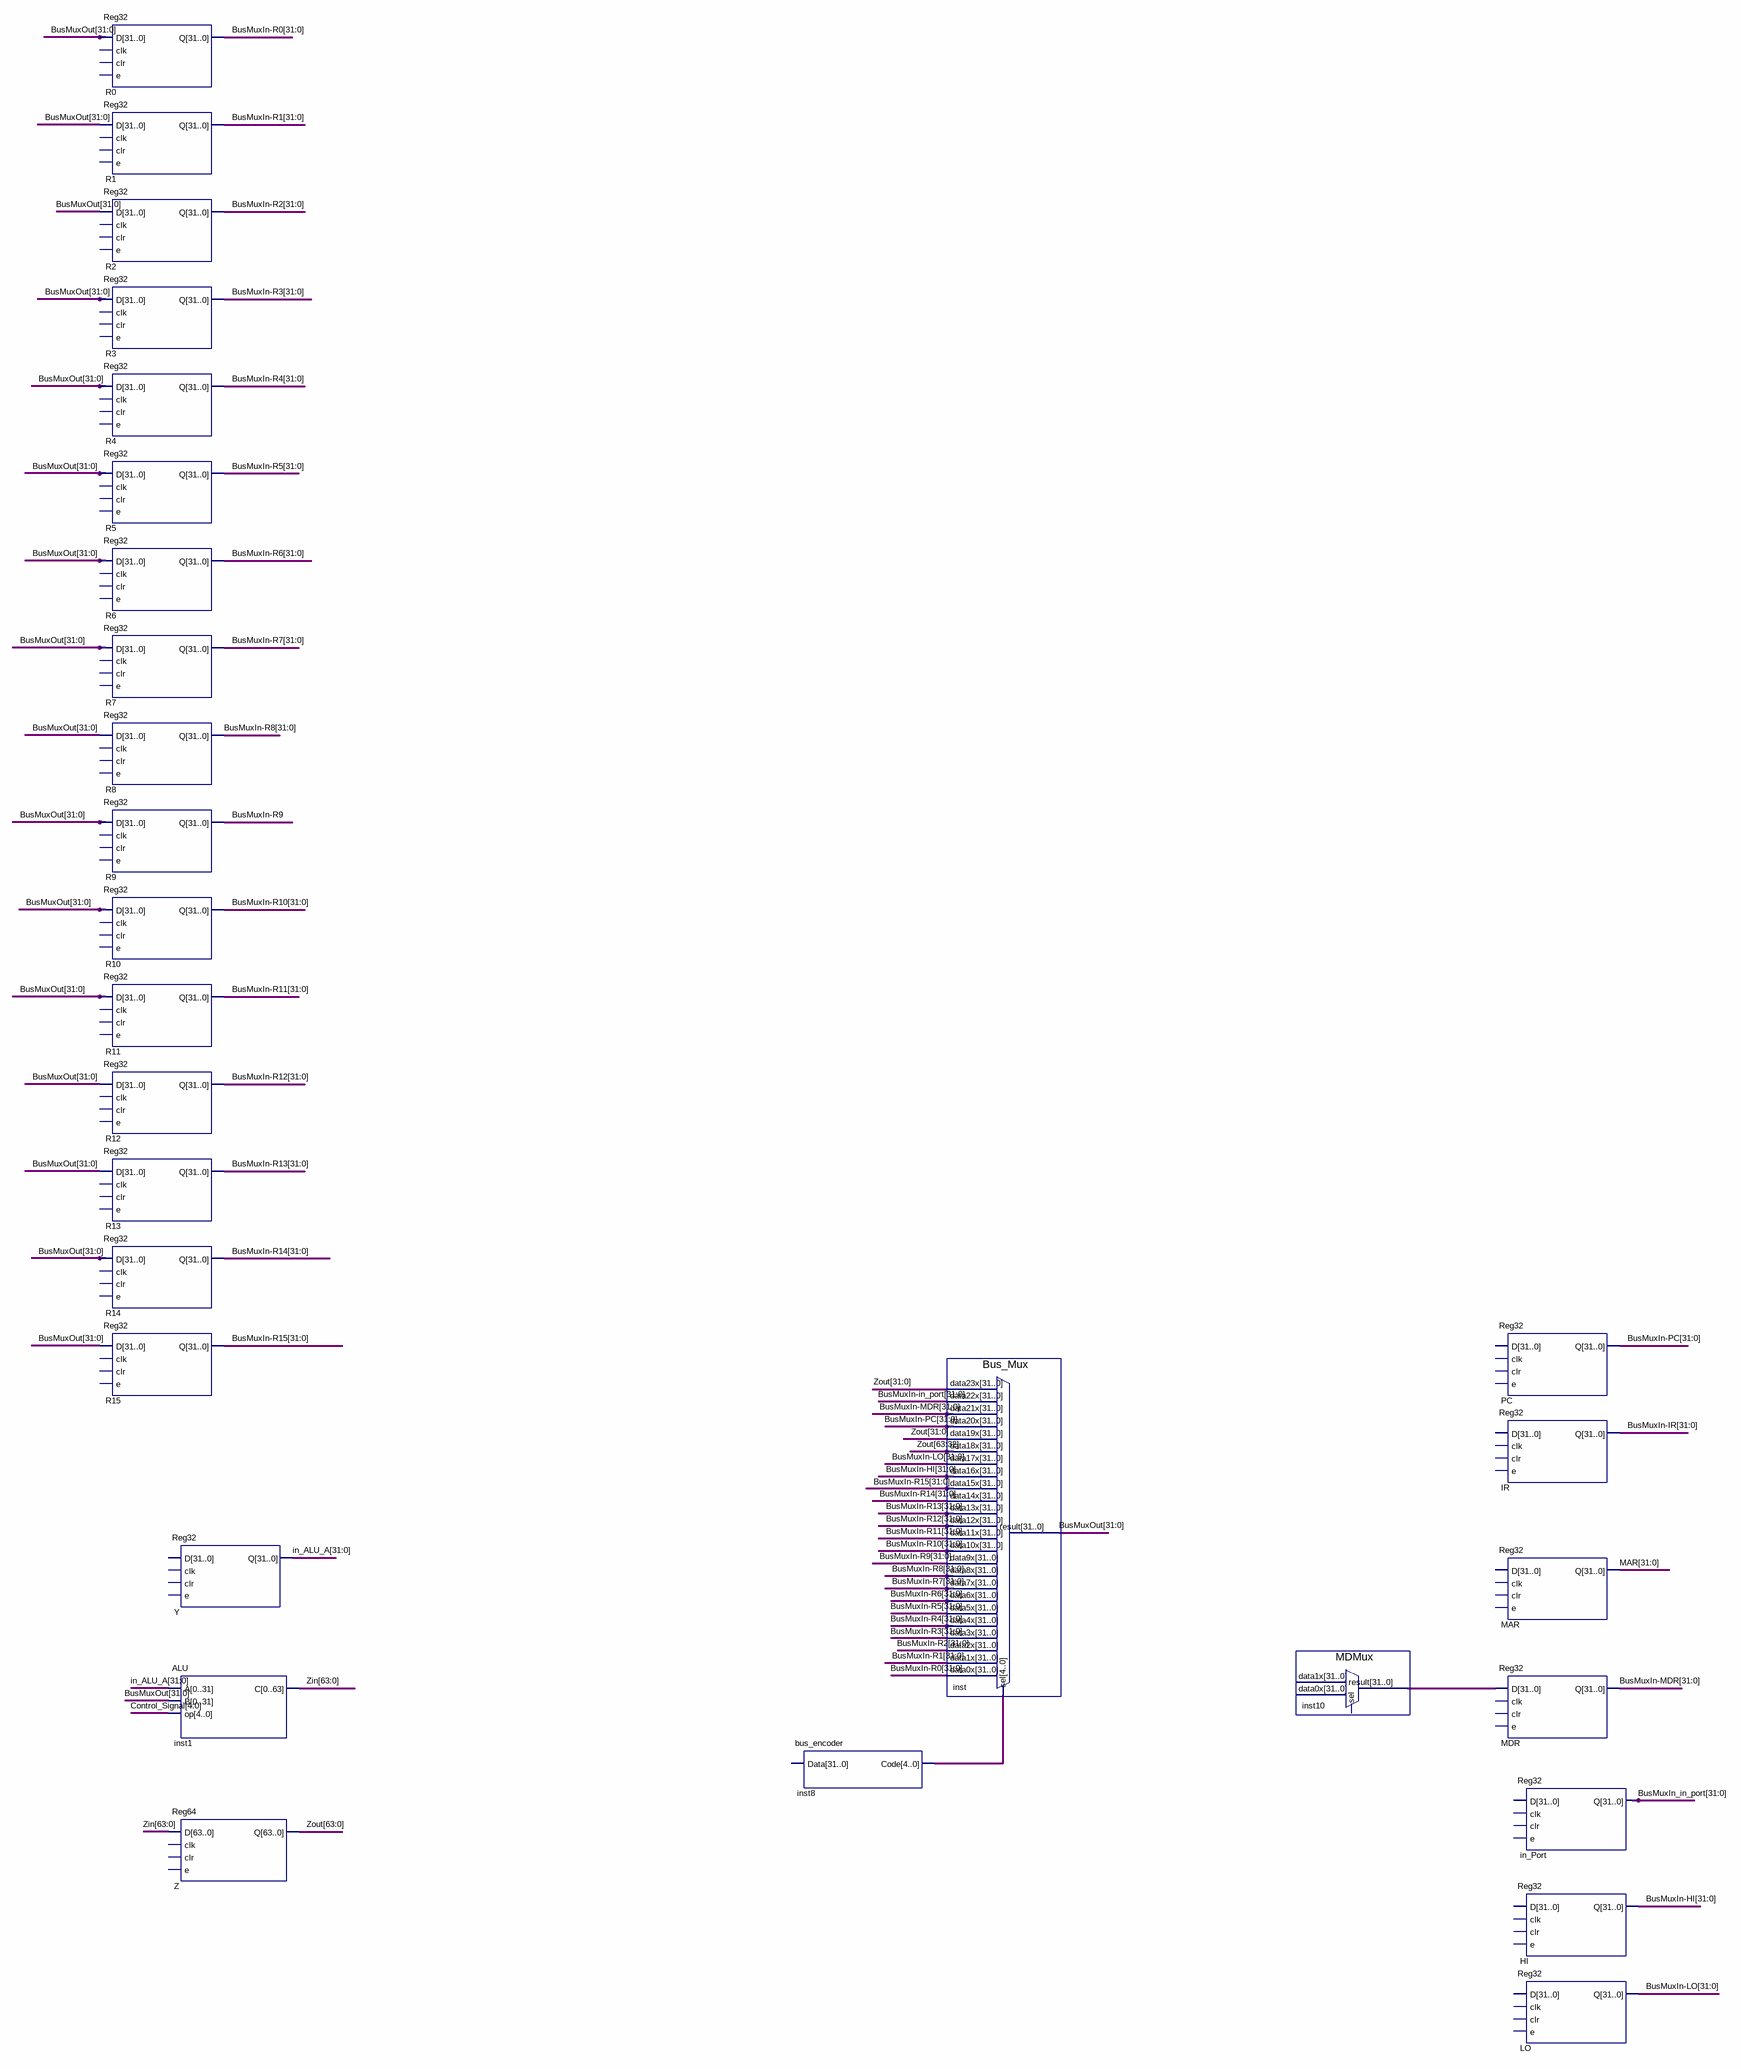
[diagram p0: schematic sheet]
// Quartus schematic CPU.bdf as structural Verilog: 29 symbols, 0 pins
module CPU (
);

  wire \BusMuxIn-R9_1bit ;
  wire [4:0] Control_Signal, inst8_code;
  wire [31:0] \BusMuxIn-HI , \BusMuxIn-in_port , \BusMuxIn-IR , \BusMuxIn-LO , \BusMuxIn-MDR , \BusMuxIn-PC ,
       \BusMuxIn-R0 , \BusMuxIn-R1 , \BusMuxIn-R2 , \BusMuxIn-R3 , \BusMuxIn-R4 , \BusMuxIn-R5 ,
       \BusMuxIn-R6 , \BusMuxIn-R7 , \BusMuxIn-R8 , \BusMuxIn-R9 , \BusMuxIn-R10 , \BusMuxIn-R11 ,
       \BusMuxIn-R12 , \BusMuxIn-R13 , \BusMuxIn-R14 , \BusMuxIn-R15 , BusMuxIn_in_port, BusMuxOut, in_ALU_A,
       inst10_result, MAR;
  wire [63:0] Zin, Zout;

  Reg32 R0 (.D(BusMuxOut), .Q(\BusMuxIn-R0 ));  // open: clk, clr, e
  Reg32 R1 (.D(BusMuxOut), .Q(\BusMuxIn-R1 ));  // open: clk, clr, e
  Reg32 R2 (.D(BusMuxOut), .Q(\BusMuxIn-R2 ));  // open: clk, clr, e
  Reg32 R3 (.D(BusMuxOut), .Q(\BusMuxIn-R3 ));  // open: clk, clr, e
  Reg32 R4 (.D(BusMuxOut), .Q(\BusMuxIn-R4 ));  // open: clk, clr, e
  Reg32 R5 (.D(BusMuxOut), .Q(\BusMuxIn-R5 ));  // open: clk, clr, e
  Reg32 R6 (.D(BusMuxOut), .Q(\BusMuxIn-R6 ));  // open: clk, clr, e
  Reg32 R7 (.D(BusMuxOut), .Q(\BusMuxIn-R7 ));  // open: clk, clr, e
  Reg32 R8 (.D(BusMuxOut), .Q(\BusMuxIn-R8 ));  // open: clk, clr, e
  Reg32 R9 (.D(BusMuxOut), .Q(\BusMuxIn-R9_1bit ));  // open: clk, clr, e
  Reg32 R10 (.D(BusMuxOut), .Q(\BusMuxIn-R10 ));  // open: clk, clr, e
  Reg32 R11 (.D(BusMuxOut), .Q(\BusMuxIn-R11 ));  // open: clk, clr, e
  Reg32 R12 (.D(BusMuxOut), .Q(\BusMuxIn-R12 ));  // open: clk, clr, e
  Reg32 R13 (.D(BusMuxOut), .Q(\BusMuxIn-R13 ));  // open: clk, clr, e
  Reg32 R14 (.D(BusMuxOut), .Q(\BusMuxIn-R14 ));  // open: clk, clr, e
  Reg32 R15 (.D(BusMuxOut), .Q(\BusMuxIn-R15 ));  // open: clk, clr, e
  Reg32 Y (.Q(in_ALU_A));  // open: D, clk, clr, e
  ALU inst1 (.A(in_ALU_A), .B(BusMuxOut), .op(Control_Signal), .C(Zin));
  Reg64 Z (.D(Zin), .Q(Zout));  // open: clk, clr, e
  bus_encoder inst8 (.Code(inst8_code));  // open: Data
  Bus_Mux inst (
    .data23x(Zout[31:0]), .data22x(\BusMuxIn-in_port ), .data21x(\BusMuxIn-MDR ), .data20x(\BusMuxIn-PC ),
    .data19x(Zout[31:0]), .data18x(Zout[63:32]), .data17x(\BusMuxIn-LO ), .data16x(\BusMuxIn-HI ),
    .data15x(\BusMuxIn-R15 ), .data14x(\BusMuxIn-R14 ), .data13x(\BusMuxIn-R13 ), .data12x(\BusMuxIn-R12 ),
    .data11x(\BusMuxIn-R11 ), .data10x(\BusMuxIn-R10 ), .data9x(\BusMuxIn-R9 ), .data8x(\BusMuxIn-R8 ),
    .data7x(\BusMuxIn-R7 ), .data6x(\BusMuxIn-R6 ), .data5x(\BusMuxIn-R5 ), .data4x(\BusMuxIn-R4 ),
    .data3x(\BusMuxIn-R3 ), .data2x(\BusMuxIn-R2 ), .data1x(\BusMuxIn-R1 ), .data0x(\BusMuxIn-R0 ),
    .sel(inst8_code), .result(BusMuxOut));
  MDMux inst10 (.result(inst10_result));  // open: data1x, data0x, sel
  Reg32 PC (.Q(\BusMuxIn-PC ));  // open: D, clk, clr, e
  Reg32 IR (.Q(\BusMuxIn-IR ));  // open: D, clk, clr, e
  Reg32 u_MAR (.Q(MAR));  // open: D, clk, clr, e
  Reg32 MDR (.D(inst10_result), .Q(\BusMuxIn-MDR ));  // open: clk, clr, e
  Reg32 in_Port (.Q(BusMuxIn_in_port));  // open: D, clk, clr, e
  Reg32 HI (.Q(\BusMuxIn-HI ));  // open: D, clk, clr, e
  Reg32 LO (.Q(\BusMuxIn-LO ));  // open: D, clk, clr, e
endmodule
